# Altium project PCB_Final.PrjPcb
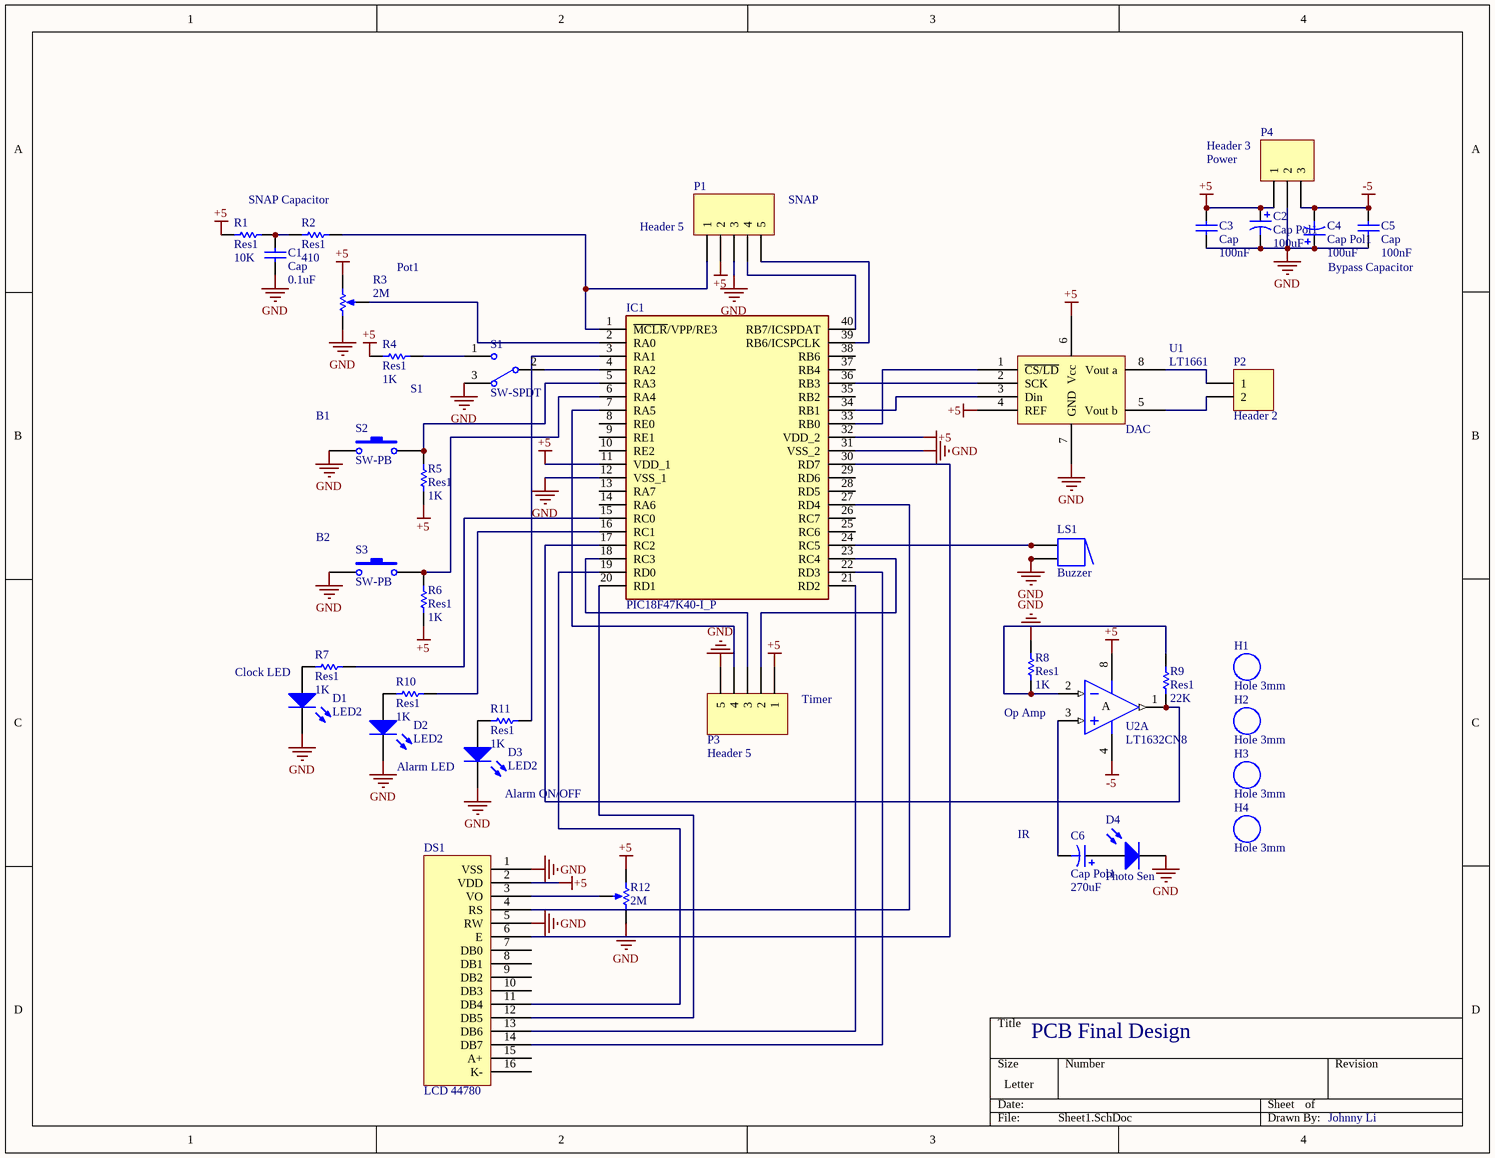
[diagram p0: Sheet1.SchDoc]
1 sheet, 38 parts. Net scope: global (net labels, ports and power ports of the same name join across sheets).
Board file: PCB1.PcbDoc

## Sheet Sheet1.SchDoc
size Letter

### Parts
C1  Cap  value 0.1uF  [RAD-0.3]
C2  Cap Pol1  value 100uF  [RAD-0.2]
C3  Cap  value 100nF  [RAD-0.3]
C4  Cap Pol1  value 100uF  [RAD-0.2]
C5  Cap  value 100nF  [RAD-0.3]
C6  Cap Pol1  value 270uF  [RAD-0.2]
D1  LED2  [3.2X1.6X1.1]
D2  LED2  [3.2X1.6X1.1]
D3  LED2  [3.2X1.6X1.1]
D4  Photo Sen  [PIN2]
DS1  LCD 44780  [OLED 16x2]
H1  Hole 3mm  [Hole 3mm]
H2  Hole 3mm  [Hole 3mm]
H3  Hole 3mm  [Hole 3mm]
H4  Hole 3mm  [Hole 3mm]
IC1  PIC18F47K40-I_P  [DIP1543W58P254L5175H635Q40N]
LS1  Buzzer  [ABSM-1574]
P1  Header 5  [HDR1X5]
P2  Header 2  [HDR1X2]
P3  Header 5  [HDR1X5]
P4  Header 3  [HDR1X3]
R1  Res1  value 10K  [AXIAL-0.3]
R2  Res1  value 410  [AXIAL-0.3]
R3  value 2M  [CT2260-ND]  (hidden comment: RPot_7)
R4  Res1  value 1K  [AXIAL-0.3]
R5  Res1  value 1K  [AXIAL-0.3]
R6  Res1  value 1K  [AXIAL-0.3]
R7  Res1  value 1K  [AXIAL-0.3]
R8  Res1  value 1K  [AXIAL-0.3]
R9  Res1  value 22K  [AXIAL-0.3]
R10  Res1  value 1K  [AXIAL-0.3]
R11  Res1  value 1K  [AXIAL-0.3]
R12  value 2M  [CT2260-ND]  (hidden comment: RPot_7)
S1  SW-SPDT  [SW DPST jameco]
S2  SW-PB  [SPST-2]
S3  SW-PB  [SPST-2]
U1  LT1661  [DIP-8]
U2  LT1632CN8  [SO08]  (part A of 2)

### Nets
+5: C2.1 C3.2 DS1.2(VDD) IC1.11(VDD_1) IC1.32(VDD_2) P1.2 P3.1 P4.1 R1.1 R3.3(BOT) R4.1 R5.1 R6.1 R12.1(TOP) U1.4(REF) U1.6(Vcc) U2.8(V+)
-5: C4.2 C5.2 P4.3 U2.4(V-)
GND: C1.1 C2.2 C3.1 C4.1 C5.1 D1.2(K) D2.2(K) D3.2(K) D4.2(K) DS1.1(VSS) DS1.5(RW) IC1.12(VSS_1) IC1.31(VSS_2) LS1.2 LS1.2A P1.3 P3.5 P4.2 R3.1(TOP) R8.2 R12.3(BOT) S1.3 S2.1 S3.1 U1.7(GND)
NetC1_2: C1.2 R1.2 R2.1
NetC6_1: C6.1 D4.1(A)
NetC6_2: C6.2 U2.3(IN+)
NetD1_1: D1.1(A) R7.1
NetD2_1: D2.1(A) R10.1
NetD3_1: D3.1(A) R11.1
NetDS1_3: DS1.3(VO) R12.2(TAP)
NetDS1_4: DS1.4(RS) IC1.27(RD4)
NetDS1_6: DS1.6(E) IC1.30(RD7)
NetDS1_11: DS1.11(DB4) IC1.19(RD0)
NetDS1_12: DS1.12(DB5) IC1.20(RD1)
NetDS1_13: DS1.13(DB6) IC1.21(RD2)
NetDS1_14: DS1.14(DB7) IC1.22(RD3)
NetIC1_1: IC1.1(~{MCLR}/VPP/RE3) P1.1 R2.2
NetIC1_2: IC1.2(RA0) R3.2(TAP)
NetIC1_3: IC1.3(RA1) R11.2
NetIC1_4: IC1.4(RA2) S1.2
NetIC1_5: IC1.5(RA3) R5.2 S2.2
NetIC1_6: IC1.6(RA4) R6.2 S3.2
NetIC1_7: IC1.7(RA5) P3.4
NetIC1_15: IC1.15(RC0) R7.2
NetIC1_16: IC1.16(RC1) R10.2
NetIC1_17: IC1.17(RC2) R9.1 U2.1(OUT)
NetIC1_18: IC1.18(RC3) P3.3
NetIC1_23: IC1.23(RC4) P3.2
NetIC1_24: IC1.24(RC5) LS1.1 LS1.1A
NetIC1_33: IC1.33(RB0) U1.1(~{CS/LD})
NetIC1_34: IC1.34(RB1) U1.3(Din)
NetIC1_36: IC1.36(RB3) U1.2(SCK)
NetIC1_39: IC1.39(RB6/ICSPCLK) P1.5
NetIC1_40: IC1.40(RB7/ICSPDAT) P1.4
NetP2_1: P2.1 U1.8(Vout_a)
NetP2_2: P2.2 U1.5(Vout_b)
NetR4_2: R4.2 S1.1
NetR8_1: R8.1 R9.2 U2.2(IN-)

Not connected (* = marked no-connect by the designer): DS1 7(DB0) 8(DB1) 9(DB2) 10(DB3) 15(A+) 16(K-); IC1 8(RE0) 9(RE1) 10(RE2) 13(RA7) 14(RA6) 25(RC6) 26(RC7) 28(RD5) 29(RD6) 35(RB2) 37(RB4) 38(RB6)

### Notes on the sheet
- Power
- SNAP Capacitor
- (near P1) SNAP
- (near R3) Pot1
- Bypass Capacitor
- (near S2) B1
- (near R4) S1
- (near U1) DAC
- (near S3) B2
- Clock LED
- (near P3) Timer
- Alarm LED
- Op Amp
- (near D3) Alarm ON/OFF
- (near C6) IR
- PCB Final Design
- Johnny Li
- (in symbol LT1632CN8, part A) A

### Library data of the parts
C1 C3 C5 = Cap: Capacitor; Published: 8-Jun-2000; LatestRevisionDate: 17-Jul-2002; LatestRevisionNote: Re-released for DXP Platform.; PackageReference: RAD-0.3; Publisher: Altium Limited; PackageDescription: Radial Cap, Thru-Hole; 2 Leads; 0.3 in Pin Spacing
C2 C4 C6 = Cap Pol1: Polarized Capacitor (Radial); Published: 8-Jun-2000; LatestRevisionDate: 17-Jul-2002; LatestRevisionNote: Re-released for DXP Platform.; PackageReference: RB7.6-15; Publisher: Altium Limited; PackageDescription: Polarized Capacitor (Radial); 2 Leads
D1-D3 = LED2: Typical RED, GREEN, YELLOW, AMBER GaAs LED; Published: 8-Jun-2000; LatestRevisionDate: 17-Jul-2002; LatestRevisionNote: Re-released for DXP Platform.; PackageVersion: Feb-2002; PackageReference: 3.2X1.6X1.1; Publisher: Altium Limited; PackageDescription: SM LED; 2 Flat Leads
D4 = Photo Sen: Photosensitive Diode; Published: 24-Mar-1999; LatestRevisionDate: 17-Jul-2002; LatestRevisionNote: Re-released for DXP Platform.; PackageReference: PIN2; Publisher: Altium Limited
IC1 = PIC18F47K40-I_P: Integrated Circuit; Manufacturer_Name: Microchip; Manufacturer_Part_Number: PIC18F47K40-I/P; Datasheet Link: https://componentsearchengine.com/Datasheets/2/PIC18F47K40-I_P.pdf; Height: 6.35mm; Mouser Part Number: 579-PIC18F47K40-I/P; Mouser Price/Stock: https://www.mouser.com/Search/Refine.aspx?Keyword=579-PIC18F47K40-I%2FP; RS Part Number: 1262152P; RS Price/Stock: http://uk.rs-online.com/web/p/products/1262152P
LS1 = Buzzer: Magnetic Transducer Buzzer; Published: 24-Mar-1999; LatestRevisionDate: 17-Dec-2003; LatestRevisionNote: Schematic revised, PCB Footprint replaced.; DatasheetVersion: 17-Dec-2003; PackageReference: ABSM-1574; Publisher: Altium Limited; PackageDescription: Magnetic Transducer Buzzer; ComponentLink1Description: Manufacturer Link; ComponentLink1URL: http://www.megastar.com/linecard/buzzmode/index.php
P1 P3 = Header 5: Header, 5-Pin; LatestRevisionDate: 17-Jul-2002; LatestRevisionNote: Re-released for DXP Platform.; Publisher: Altium Limited
P2 = Header 2: Header, 2-Pin; LatestRevisionDate: 17-Jul-2002; LatestRevisionNote: Re-released for DXP Platform.; Publisher: Altium Limited
P4 = Header 3: Header, 3-Pin; LatestRevisionDate: 17-Jul-2002; LatestRevisionNote: Re-released for DXP Platform.; Publisher: Altium Limited
R1 R2 R4-R11 = Res1: Resistor; Published: 8-Jun-2000; LatestRevisionDate: 17-Jul-2002; LatestRevisionNote: Re-released for DXP Platform.; PackageReference: AXIAL-0.3; Publisher: Altium Limited; PackageDescription: Axial Device, Thru-Hole; 2 Leads; 0.3 in Pin Spacing
R3 R12 = RPot_4: Potentiometer; Sim Note: Enter the Resistance value and the set point into parameter fields.; Set Position: 0.5; Published: 8-Jun-2000; LatestRevisionDate: 17-Jul-2002; LatestRevisionNote: Re-released for DXP Platform.; PackageReference: VR5; Publisher: Altium Limited; PackageDescription: Variable Resistor, Thru-Hole; 3 Leads
S1 = SW-SPDT: SPDT Subminiature Toggle Switch, Right Angle Mounting, Vertical Actuation; Published: 24-Mar-1999; LatestRevisionDate: 17-Dec-2003; LatestRevisionNote: Schematic revised, PCB Footprint replaced.; DatasheetVersion: 05-Dec-2000; PackageReference: TL36WW15050; Publisher: Altium Limited; PackageDescription: Switch; 4 Leads; ComponentLink1Description: Manufacturer Link; ComponentLink1URL: http://www.apem.com
S2 S3 = SW-PB: Switch; Published: 24-Mar-1999; LatestRevisionDate: 17-Jul-2002; LatestRevisionNote: Re-released for DXP Platform.; PackageReference: SPST-2; Publisher: Altium Limited; PackageDescription: Switch; 2 Leads
U2 = LT1632CN8: 45MHz, 45V/µs, Dual Rail-to-Rail Input and Output Precision Operational Amplifier; Note: 1455; Published: 8-Jun-2000; LatestRevisionDate: 29-May-2009; LatestRevisionNote: Component Body Added.; DatasheetVersion: 1996; PackageVersion: N8 1002; PackageReference: N8; Publisher: Altium Limited; PackageDescription: DIP, Plastic, 8-Pin, Row Spacing 7.62 mm, Pitch 2.54 mm; ComponentLink1Description: Manufacturer Link; ComponentLink1URL: http://www.linear.com/; ComponentLink2Description: Datasheet; ComponentLink2URL: http://www.linear.com/pc/downloadDocument.do?navId=H0,C1,C1154,C1009,C1022,P1642,D3055